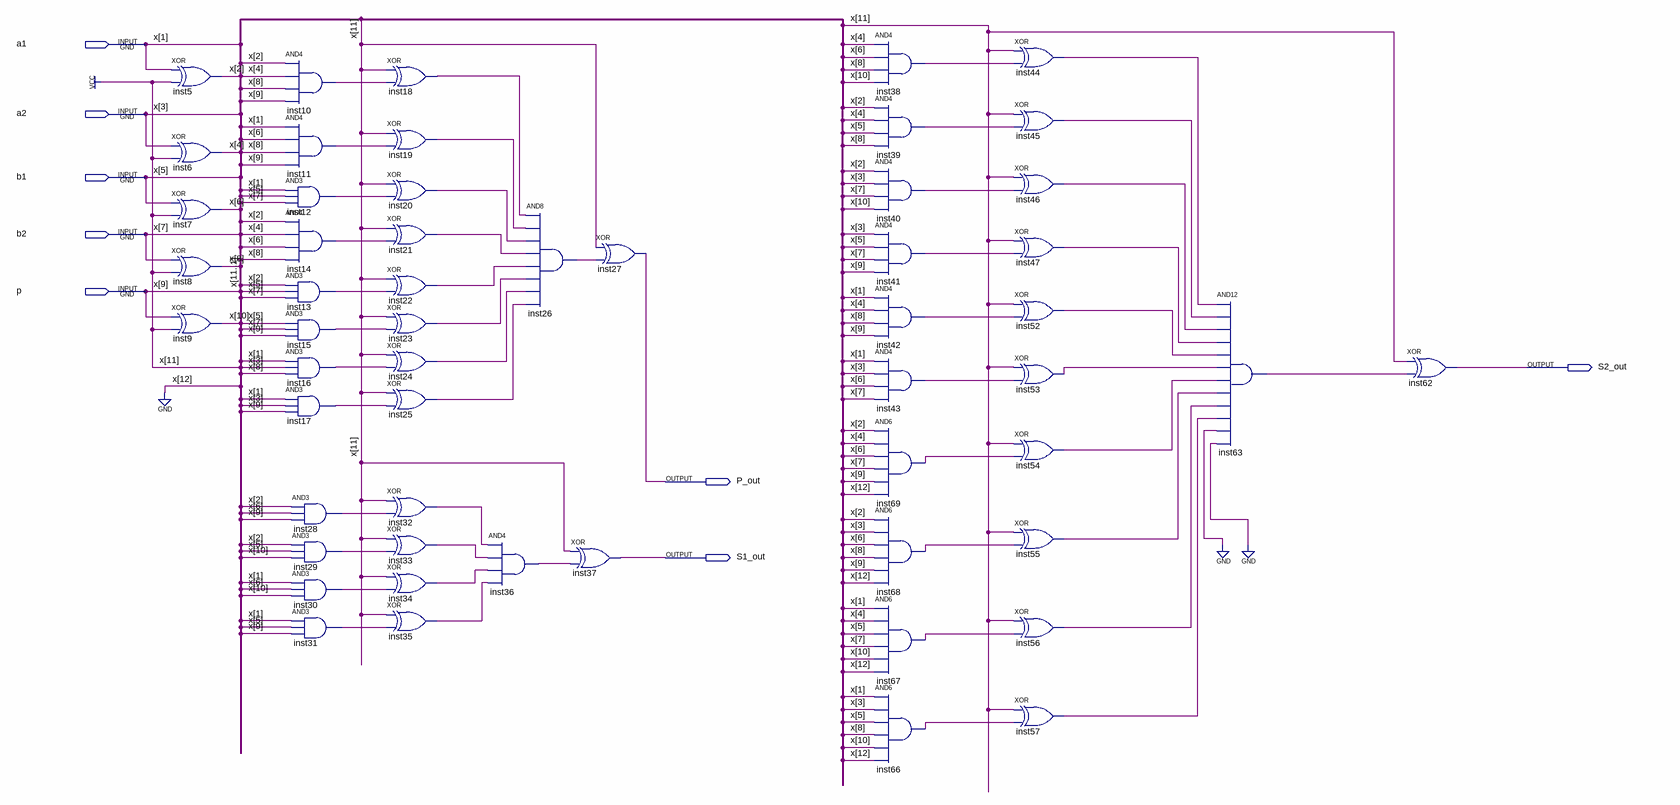
[diagram p0: schematic sheet]
// Quartus schematic cxema.bdf as structural Verilog: 55 symbols, 8 pins
module cxema (
  input  a1,
  input  a2,
  input  b1,
  input  b2,
  input  p,
  output S2_out,
  output P_out,
  output S1_out
);

  wire inst10_out, inst11_out, inst12_out, inst13_out, inst14_out, inst15_out, inst16_out, inst17_out,
       inst18_out, inst19_out, inst20_out, inst21_out, inst22_out, inst23_out, inst24_out, inst25_out,
       inst26_out, inst28_out, inst29_out, inst30_out, inst31_out, inst32_out, inst33_out, inst34_out,
       inst35_out, inst36_out, inst38_out, inst39_out, inst40_out, inst41_out, inst42_out, inst43_out,
       inst44_out, inst45_out, inst46_out, inst47_out, inst52_out, inst53_out, inst54_out, inst55_out,
       inst56_out, inst57_out, inst63_out, inst66_out, inst67_out, inst68_out, inst69_out;
  wire [10:2] x;

  xor inst5 (x[2], a1, 1'b1);
  xor inst6 (x[4], a2, 1'b1);
  xor inst7 (x[6], b1, 1'b1);
  xor inst8 (x[8], b2, 1'b1);
  xor inst9 (x[10], p, 1'b1);
  and inst10 (inst10_out, x[2], x[4], x[8], p);
  and inst11 (inst11_out, a1, x[6], x[8], p);
  and inst12 (inst12_out, a1, b1, b2);
  and inst14 (inst14_out, x[2], x[4], x[6], x[8]);
  and inst13 (inst13_out, x[2], b1, b2);
  and inst15 (inst15_out, b1, b2, p);
  and inst16 (inst16_out, a1, a2, x[8]);
  and inst17 (inst17_out, a1, a2, p);
  and inst28 (inst28_out, x[2], x[6], p);
  and inst29 (inst29_out, x[2], b1, x[10]);
  and inst30 (inst30_out, a1, x[6], x[10]);
  and inst31 (inst31_out, a1, b1, p);
  xor inst18 (inst18_out, 1'b1, inst10_out);
  xor inst19 (inst19_out, 1'b1, inst11_out);
  xor inst20 (inst20_out, 1'b1, inst12_out);
  xor inst21 (inst21_out, 1'b1, inst14_out);
  xor inst22 (inst22_out, 1'b1, inst13_out);
  xor inst23 (inst23_out, 1'b1, inst15_out);
  xor inst24 (inst24_out, 1'b1, inst16_out);
  xor inst25 (inst25_out, 1'b1, inst17_out);
  xor inst32 (inst32_out, 1'b1, inst28_out);
  xor inst33 (inst33_out, 1'b1, inst29_out);
  xor inst34 (inst34_out, 1'b1, inst30_out);
  xor inst35 (inst35_out, 1'b1, inst31_out);
  and inst26 (inst26_out, inst18_out, inst19_out, inst20_out, inst21_out, inst22_out, inst23_out, inst24_out, inst25_out);
  and inst36 (inst36_out, inst32_out, inst33_out, inst34_out, inst35_out);
  xor inst37 (S1_out, 1'b1, inst36_out);
  xor inst27 (P_out, 1'b1, inst26_out);
  and inst38 (inst38_out, x[4], x[6], x[8], x[10]);
  and inst39 (inst39_out, x[2], x[4], b1, x[8]);
  and inst40 (inst40_out, x[2], a2, b2, x[10]);
  and inst41 (inst41_out, a2, b1, b2, p);
  and inst42 (inst42_out, a1, x[4], x[8], p);
  and inst43 (inst43_out, a1, a2, x[6], b2);
  and inst69 (inst69_out, x[2], x[4], x[6], b2, p, 1'b0);
  and inst68 (inst68_out, x[2], a2, x[6], x[8], p, 1'b0);
  and inst67 (inst67_out, a1, x[4], b1, b2, x[10], 1'b0);
  and inst66 (inst66_out, a1, a2, b1, x[8], x[10], 1'b0);
  xor inst44 (inst44_out, 1'b1, inst38_out);
  xor inst45 (inst45_out, 1'b1, inst39_out);
  xor inst46 (inst46_out, 1'b1, inst40_out);
  xor inst47 (inst47_out, 1'b1, inst41_out);
  xor inst52 (inst52_out, 1'b1, inst42_out);
  xor inst53 (inst53_out, 1'b1, inst43_out);
  xor inst54 (inst54_out, 1'b1, inst69_out);
  xor inst55 (inst55_out, 1'b1, inst68_out);
  xor inst56 (inst56_out, 1'b1, inst67_out);
  xor inst57 (inst57_out, 1'b1, inst66_out);
  and inst63 (inst63_out, inst44_out, inst45_out, inst46_out, inst47_out, inst52_out, inst53_out, inst54_out, inst55_out, inst56_out, inst57_out, 1'b0, 1'b0);
  xor inst62 (S2_out, 1'b1, inst63_out);

  // Other names for the same wires on the sheet: x (some bits) = {p, b2, b1, a2, a1}
endmodule
